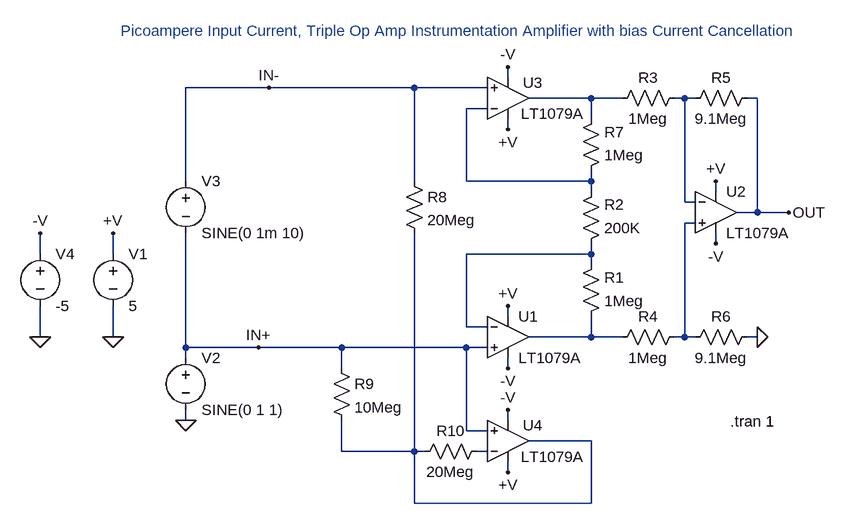
[diagram p0: schematic 1079.asc]
1079.asc, the LTspice schematic file:
Version 4
SHEET 1 896 680
WIRE 80 -160 80 -176
WIRE -288 -144 -416 -144
WIRE -64 -144 -288 -144
WIRE 48 -144 -64 -144
WIRE 208 -128 112 -128
WIRE 256 -128 208 -128
WIRE 352 -128 336 -128
WIRE 368 -128 352 -128
WIRE 464 -128 448 -128
WIRE 48 -112 16 -112
WIRE 208 -96 208 -128
WIRE 80 -80 80 -96
WIRE -416 0 -416 -144
WIRE -64 0 -64 -144
WIRE 16 0 16 -112
WIRE 208 0 208 -16
WIRE 208 0 16 0
WIRE 208 16 208 0
WIRE 400 16 400 0
WIRE 352 32 352 -128
WIRE 368 32 352 32
WIRE 464 48 464 -128
WIRE 464 48 432 48
WIRE 512 48 464 48
WIRE 368 64 352 64
WIRE 400 96 400 80
WIRE -640 112 -640 80
WIRE -528 112 -528 80
WIRE 208 112 208 96
WIRE 208 112 16 112
WIRE 208 128 208 112
WIRE 80 208 80 192
WIRE 16 224 16 112
WIRE 48 224 16 224
WIRE -640 240 -640 192
WIRE -528 240 -528 192
WIRE 208 240 208 208
WIRE 208 240 112 240
WIRE 256 240 208 240
WIRE 352 240 352 64
WIRE 352 240 336 240
WIRE 368 240 352 240
WIRE 464 240 448 240
WIRE -416 256 -416 80
WIRE -304 256 -416 256
WIRE -176 256 -304 256
WIRE 16 256 -176 256
WIRE 48 256 16 256
WIRE -416 272 -416 256
WIRE -176 288 -176 256
WIRE 80 288 80 272
WIRE -416 368 -416 352
WIRE 80 368 80 352
WIRE 16 384 16 256
WIRE 48 384 16 384
WIRE 208 400 112 400
WIRE -176 416 -176 368
WIRE -64 416 -64 80
WIRE -64 416 -176 416
WIRE -48 416 -64 416
WIRE 48 416 32 416
WIRE 80 448 80 432
WIRE -64 496 -64 416
WIRE 208 496 208 400
WIRE 208 496 -64 496
FLAG -528 240 0
FLAG 80 192 +V
FLAG -528 80 +V
FLAG -416 368 0
FLAG 80 -80 +V
FLAG 400 0 +V
FLAG 464 240 0
FLAG 80 448 +V
FLAG 512 48 OUT
FLAG -288 -144 IN-
FLAG -304 256 IN+
FLAG -640 240 0
FLAG -640 80 -V
FLAG 80 -176 -V
FLAG 400 96 -V
FLAG 80 288 -V
FLAG 80 352 -V
SYMBOL voltage -528 96 R0
SYMATTR InstName V1
SYMATTR Value 5
SYMBOL res 192 224 M180
WINDOW 0 36 76 Left 0
WINDOW 3 36 40 Left 0
SYMATTR InstName R1
SYMATTR Value 1Meg
SYMBOL res 192 112 M180
WINDOW 0 36 76 Left 0
WINDOW 3 36 40 Left 0
SYMATTR InstName R2
SYMATTR Value 200K
SYMBOL voltage -416 -16 R0
SYMATTR InstName V3
SYMATTR Value SINE(0 1m 10)
SYMBOL res 352 -144 R90
WINDOW 0 0 56 VBottom 0
WINDOW 3 32 56 VTop 0
SYMATTR InstName R3
SYMATTR Value 1Meg
SYMBOL res 352 224 R90
WINDOW 0 0 56 VBottom 0
WINDOW 3 32 56 VTop 0
SYMATTR InstName R4
SYMATTR Value 1Meg
SYMBOL res 464 -144 R90
WINDOW 0 0 56 VBottom 0
WINDOW 3 32 56 VTop 0
SYMATTR InstName R5
SYMATTR Value 9.1Meg
SYMBOL res 464 224 R90
WINDOW 0 0 56 VBottom 0
WINDOW 3 32 56 VTop 0
SYMATTR InstName R6
SYMATTR Value 9.1Meg
SYMBOL res 192 0 M180
WINDOW 0 36 76 Left 0
WINDOW 3 36 40 Left 0
SYMATTR InstName R7
SYMATTR Value 1Meg
SYMBOL voltage -416 256 R0
SYMATTR InstName V2
SYMATTR Value SINE(0 1 1)
SYMBOL res -80 -16 R0
SYMATTR InstName R8
SYMATTR Value 20Meg
SYMBOL res -192 272 R0
SYMATTR InstName R9
SYMATTR Value 10Meg
SYMBOL res 48 400 R90
WINDOW 0 0 56 VBottom 0
WINDOW 3 32 56 VTop 0
SYMATTR InstName R10
SYMATTR Value 20Meg
SYMBOL voltage -640 96 R0
SYMATTR InstName V4
SYMATTR Value -5
SYMBOL opamps\\LT1079A 80 176 R0
SYMATTR InstName U1
SYMBOL opamps\\LT1079A 400 -16 R0
SYMATTR InstName U2
SYMBOL opamps\\LT1079A 80 -64 M180
WINDOW 0 23 88 Left 0
WINDOW 3 20 40 Left 0
SYMATTR InstName U3
SYMBOL opamps\\LT1079A 80 464 M180
WINDOW 0 23 88 Left 0
WINDOW 3 20 40 Left 0
SYMATTR InstName U4
TEXT 422 370 Left 0 !.tran 1
TEXT 8 -216 Bottom 0 ;Picoampere Input Current, Triple Op Amp Instrumentation Amplifier with bias Current Cancellation

The netlist it stands for:
* 1079.asc
V1 +V 0 5
R1 N006 N005 1Meg
R2 N005 N003 200K
V3 IN- IN+ SINE(0 1m 10)
R3 N002 N001 1Meg
R4 N004 N006 1Meg
R5 OUT N002 9.1Meg
R6 0 N004 9.1Meg
R7 N003 N001 1Meg
V2 IN+ 0 SINE(0 1 1)
R8 IN- N007 20Meg
R9 IN+ N007 10Meg
R10 N008 N007 20Meg
V4 -V 0 -5
XU1 IN+ N005 +V -V N006 LT1079A  ; pins In+ In- V+ V- OUT
XU2 N004 N002 +V -V OUT LT1079A  ; pins In+ In- V+ V- OUT
XU3 IN- N003 +V -V N001 LT1079A  ; pins In+ In- V+ V- OUT
XU4 IN+ N008 +V -V N007 LT1079A  ; pins In+ In- V+ V- OUT
.tran 1
* Picoampere Input Current, Triple Op Amp Instrumentation Amplifier with bias Current Cancellation
.backanno
.end